# EAGLE schematic V1d (EAGLE 6.5.0)
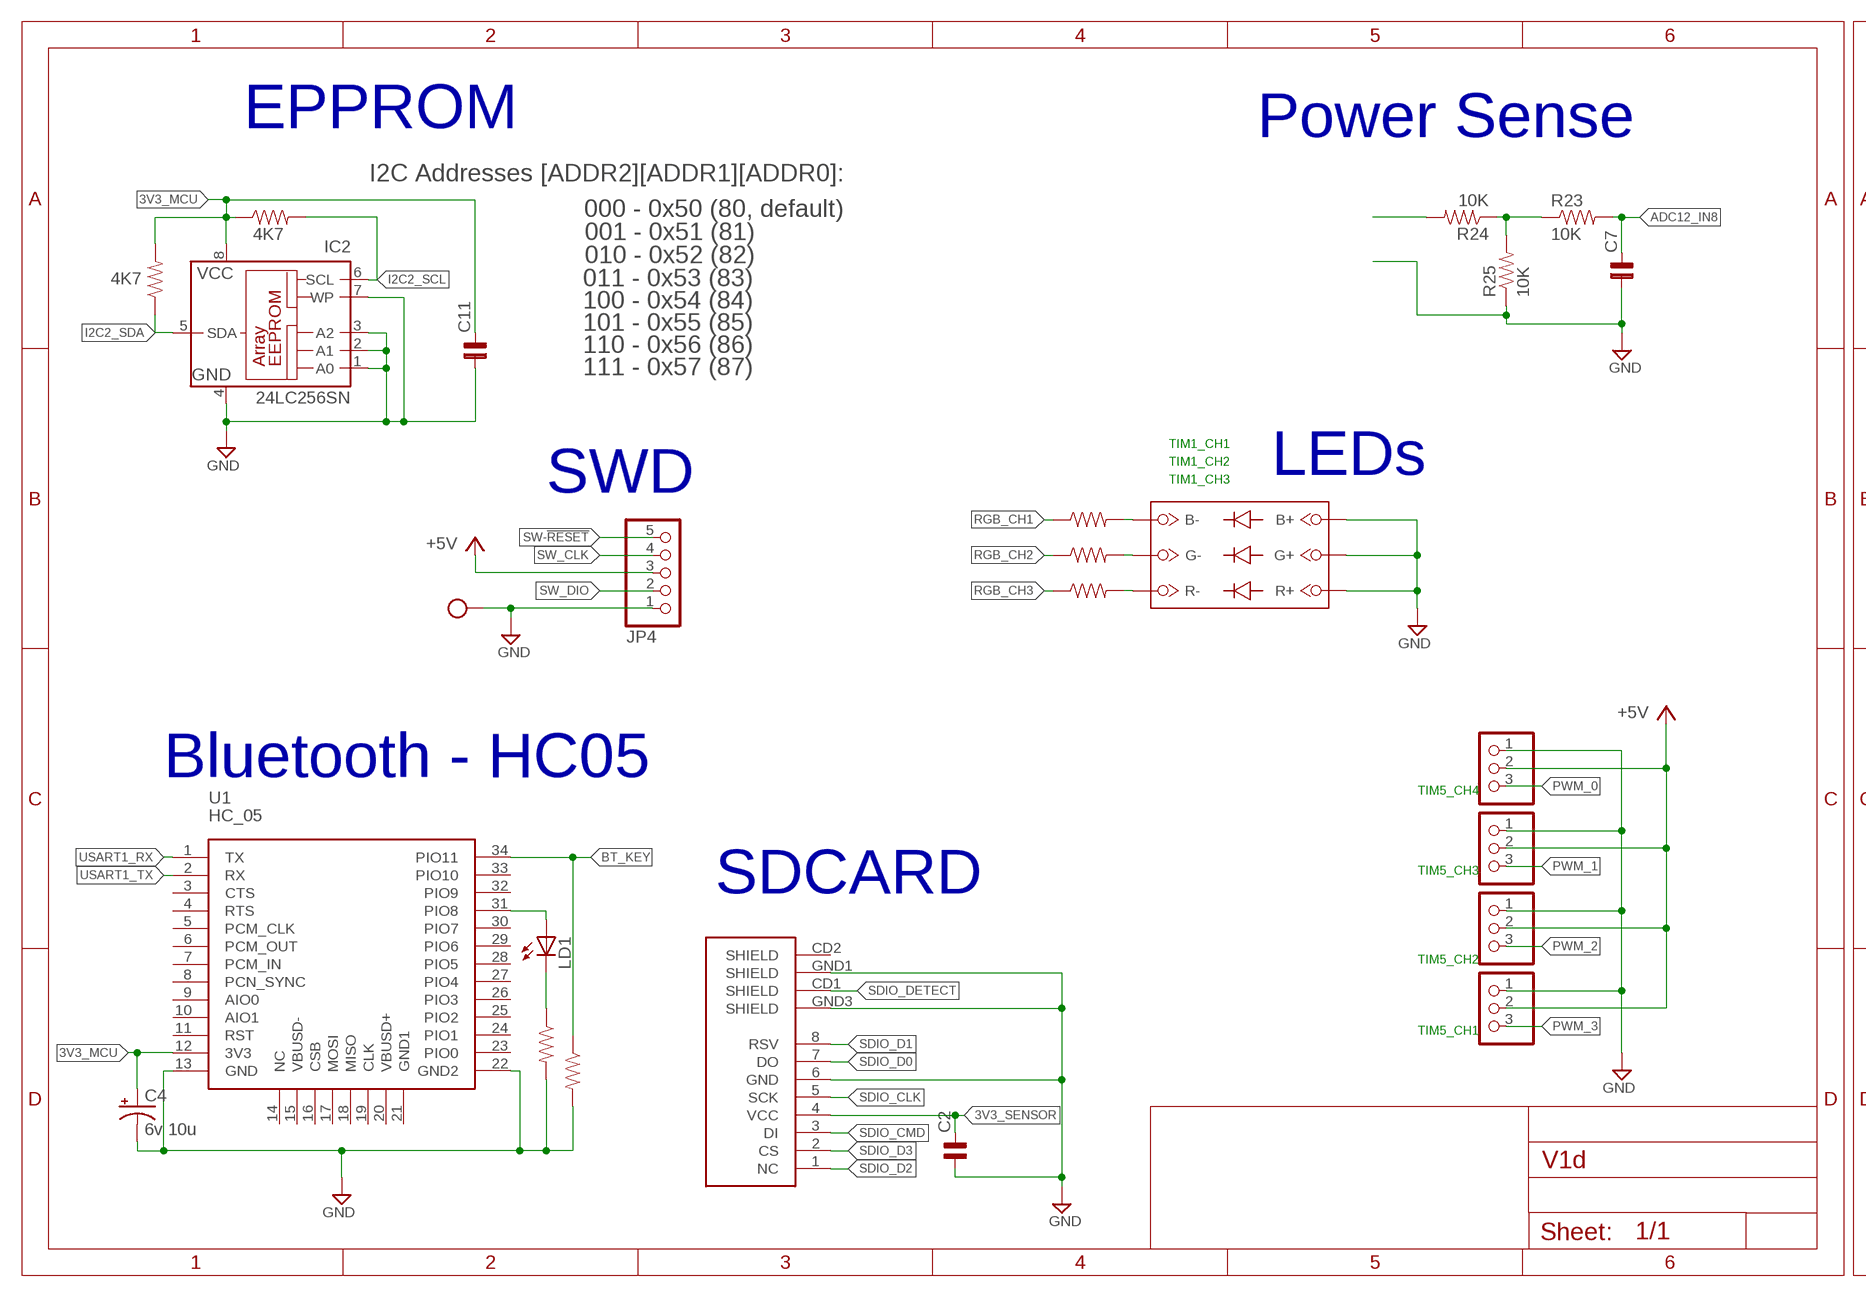
[diagram p0: schematic, sheet 1, part 1 of 2]
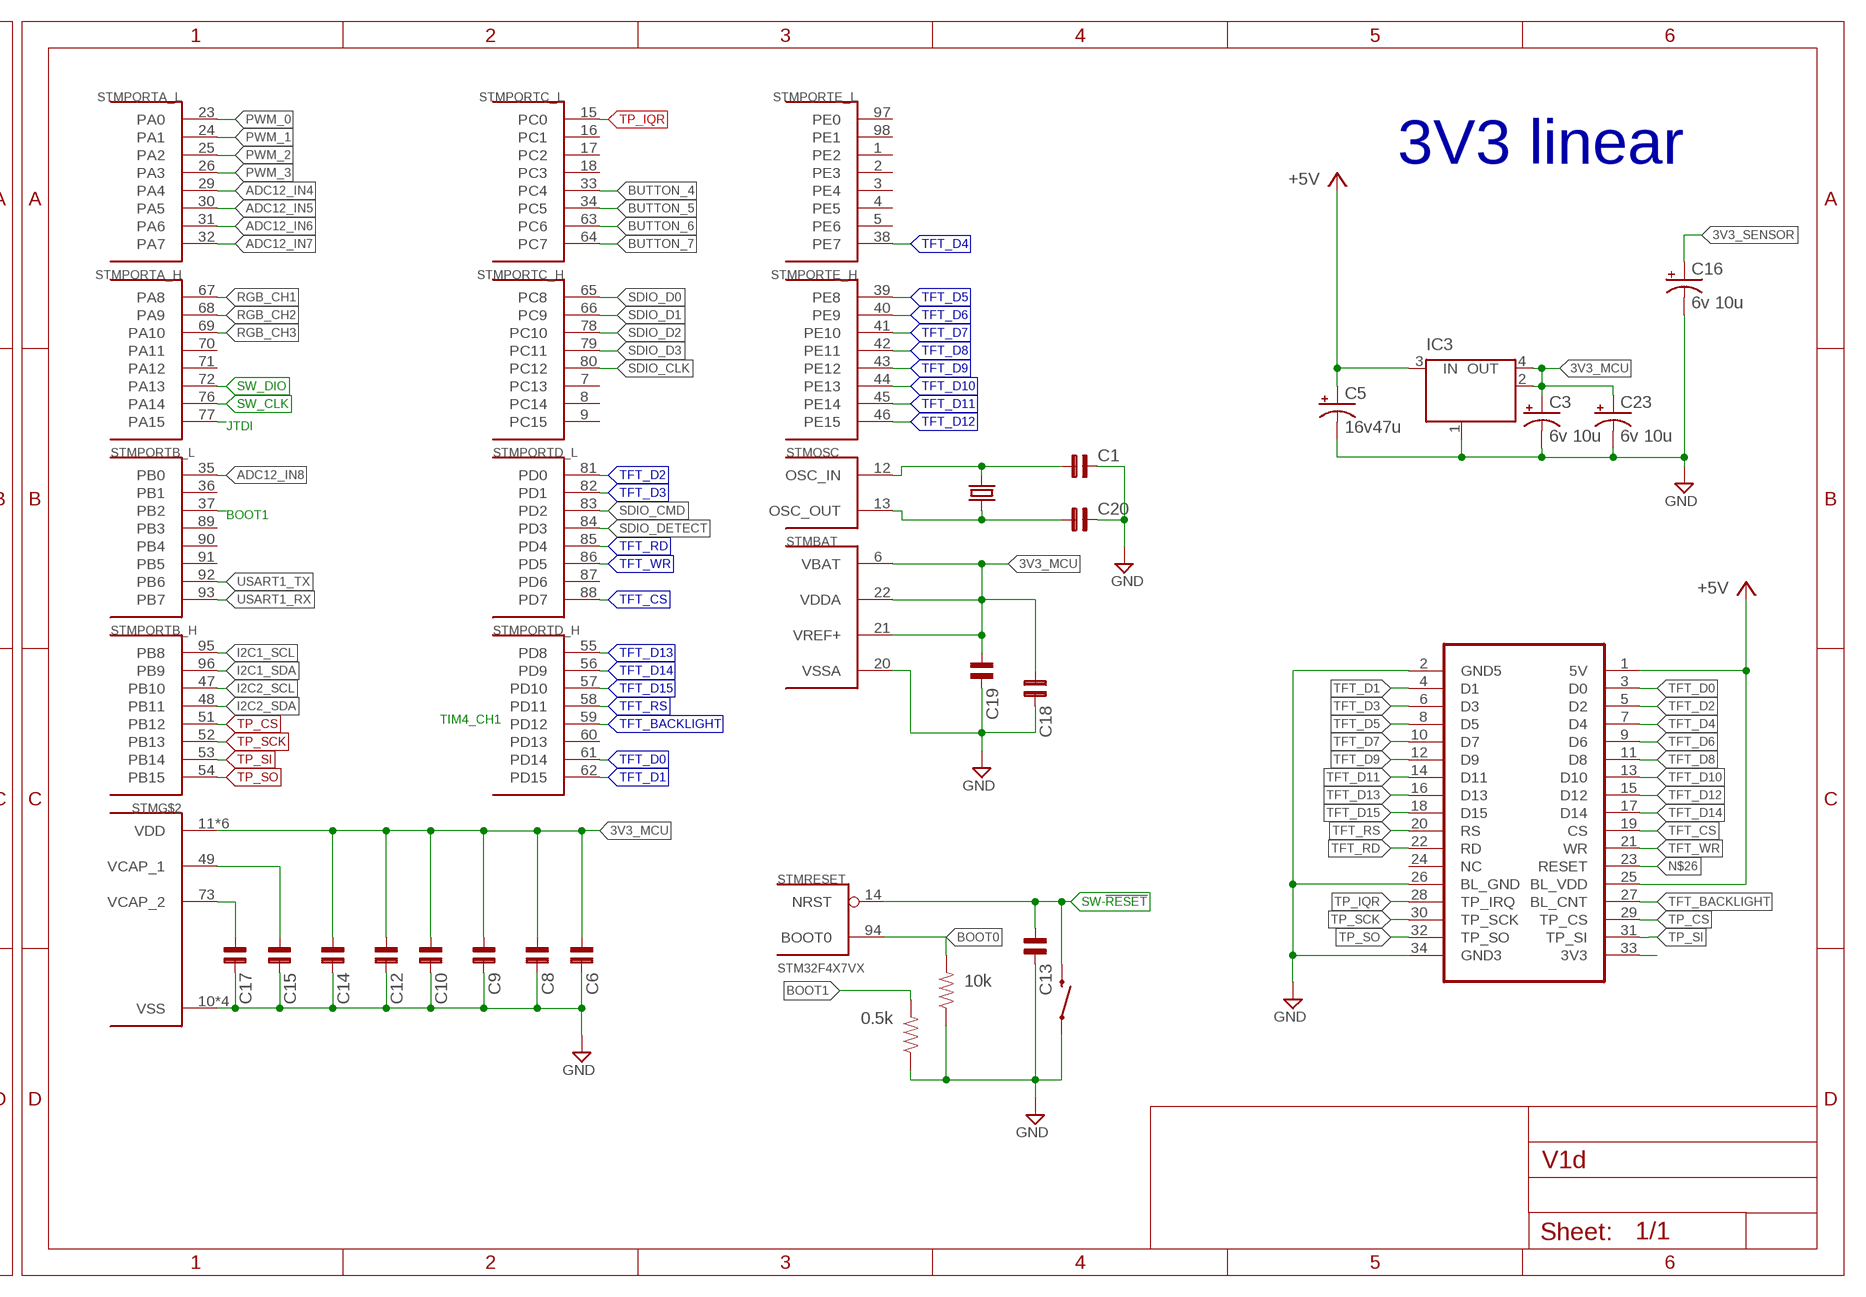
[diagram p1: schematic, sheet 1, part 2 of 2]

## Parts
C1  C-NP-SMD-0603  [C-0603]
C2  C-NP-SMD-0603  [C-0603]
C3  6v 10u  CPOL-USSMCA  [SMC_A]
C4  6v 10u  CPOL-USSMCA  [SMC_A]
C5  16v47u  CPOL-USSMCC  [SMC_C]
C6  C-NP-SMD-0603  [C-0603]
C7  C-NP-SMD-0603  [C-0603]
C8  C-NP-SMD-0603  [C-0603]
C9  C-NP-SMD-0603  [C-0603]
C10  C-NP-SMD-0603  [C-0603]
C11  C-NP-SMD-0603  [C-0603]
C12  C-NP-SMD-0603  [C-0603]
C13  C-NP-SMD-0603  [C-0603]
C14  C-NP-SMD-0603  [C-0603]
C15  C-NP-SMD-0603  [C-0603]
C16  6v 10u  CPOL-USSMCA  [SMC_A]
C17  C-NP-SMD-0603  [C-0603]
C18  C-NP-SMD-0603  [C-0603]
C19  C-NP-SMD-0603  [C-0603]
C20  C-NP-SMD-0603  [C-0603]
C23  6v 10u  CPOL-USSMCA  [SMC_A]
IC2  24LC256SN  [SO-08]
IC3  LINEAR_MC33269ST-3.3T3  [LINEAR_SOT223]
JP1  PINHD-1X3_2.54-90°  [1X03/90]
JP4  PINHD-1X5_2.54-90°  [1X05/90]
JP5  PINHD-1X3_2.54-90°  [1X03/90]
JP6  PINHD-1X3_2.54-90°  [1X03/90]
JP11  PINHD-1X3_2.54-90°  [1X03/90]
LD1  LEDCHIPLED_0805  [CHIPLED_0805]
R2  10K  SPARKFUN_RESISTOR0603-RES  [SPARKFUN_0603-RES]
R3  10K  SPARKFUN_RESISTOR0603-RES  [SPARKFUN_0603-RES]
R5  10K  SPARKFUN_RESISTOR0603-RES  [SPARKFUN_0603-RES]
R6  10K  SPARKFUN_RESISTOR0603-RES  [SPARKFUN_0603-RES]
R7  10k  SPARKFUN_RESISTOR0603-RES  [SPARKFUN_0603-RES]
R8  0.5k  SPARKFUN_RESISTOR0603-RES  [SPARKFUN_0603-RES]
R9  10K  SPARKFUN_RESISTOR0603-RES  [SPARKFUN_0603-RES]
R15  4K7  SPARKFUN_RESISTOR0603-RES  [SPARKFUN_0603-RES]
R16  4K7  SPARKFUN_RESISTOR0603-RES  [SPARKFUN_0603-RES]
R23  10K  SPARKFUN_RESISTOR0603-RES  [SPARKFUN_0603-RES]
R24  10K  SPARKFUN_RESISTOR0603-RES  [SPARKFUN_0603-RES]
R25  10K  SPARKFUN_RESISTOR0603-RES  [SPARKFUN_0603-RES]
S1  RESET  SWITCH-MOMENTARY-2-SMD-1101NE  [TACTILE-SWITCH-1101NE]
SDCARD2  microSD Socket  USD-SOCKETNEW  [MICRO-SD-SOCKET-PP]
STM  STM32F4X7VX  [TQFP100]
U1  HC_05  [BLUETOOTH_SMD]
U$3  TFT3.2  [HY32D_2]
U$12  RGB_LED  [SMD]
X1  MKDSN1,5/2-5,08  [MKDSN1,5/2-5,08]
Y1  CRYSTALHC49US  [HC49US]

## Nets
3V3_MCU: C3.+ C4.+ C6.1 C8.1 C9.1 C10.1 C11.2 C12.1 C14.1 C18.1 C19.1 C23.+ IC2.8(VCC) IC3.2(OUT) IC3.4(OUT) R15.1 R16.2 STM.6(BAT:VBAT) STM.11(VDD) STM.19(VDD) STM.21(BAT:VREF+) STM.22(BAT:VDDA) STM.28(VDD) STM.50(VDD) STM.75(VDD) STM.100(VDD) U1.12(3V3)
3V3_SENSOR: C2.2 C16.+ SDCARD2.4(VCC)
+5V: C5.+ IC3.3(IN) JP1.2 JP4.3 JP5.2 JP6.2 JP11.2 U$3.1(5V) U$3.25(BL_VDD)
ADC12_IN4: STM.29(PORTA_L:PA4)
ADC12_IN5: STM.30(PORTA_L:PA5)
ADC12_IN6: STM.31(PORTA_L:PA6)
ADC12_IN7: STM.32(PORTA_L:PA7)
ADC12_IN8: C7.2 R23.2 STM.35(PORTB_L:PB0)
BOOT0: R7.2 STM.94(RESET:BOOT0)
BOOT1: R8.2 STM.37(PORTB_L:PB2)
BT_KEY: R5.1 U1.34(PIO11)
BUTTON_4: STM.33(PORTC_L:PC4)
BUTTON_5: STM.34(PORTC_L:PC5)
BUTTON_6: STM.63(PORTC_L:PC6)
BUTTON_7: STM.64(PORTC_L:PC7)
GND: C1.2 C2.1 C3.- C4.- C5.- C6.2 C7.1 C8.2 C9.2 C10.2 C11.1 C12.2 C13.2 C14.2 C15.2 C16.- C17.2 C18.2 C19.2 C20.2 C23.- IC2.1(A0) IC2.2(A1) IC2.3(A2) IC2.4(GND) IC2.7(WP) IC3.1(GND/ADJ) JP1.1 JP4.1 JP5.1 JP6.1 JP11.1 R5.2 R7.1 R8.1 R9.2 R25.1 S1.P$1 SDCARD2.6(GND) SDCARD2.GND1(SHIELD) SDCARD2.GND3(SHIELD) STM.10(VSS) STM.20(BAT:VSSA) STM.27(VSS) STM.74(VSS) STM.99(VSS) U1.13(GND) U1.22(GND2) U$3.2(GND5) U$3.26(BL_GND) U$3.34(GND3) U$12.B+ U$12.G+ U$12.R+ X1.2
I2C1_SCL: STM.95(PORTB_H:PB8)
I2C1_SDA: STM.96(PORTB_H:PB9)
I2C2_SCL: IC2.6(SCL) R15.2 STM.47(PORTB_H:PB10)
I2C2_SDA: IC2.5(SDA) R16.1 STM.48(PORTB_H:PB11)
JTDI: STM.77(PORTA_H:PA15)
N$1: C1.1 STM.12(OSC:OSC_IN) Y1.2
N$2: R2.2 U$12.B-
N$3: R24.2
N$4: LD1.A U1.31(PIO8)
N$5: LD1.C R9.1
N$6: R3.2 U$12.G-
N$7: R6.2 U$12.R-
N$26: U$3.23(RESET)
N$27: R23.1 R24.1 R25.2
N$29: C20.1 STM.13(OSC:OSC_OUT) Y1.1
N$30: U$3.33(3V3)
N$31: C17.1 STM.73(VCAP_2)
N$32: C15.1 STM.49(VCAP_1)
PWM_0: JP6.3 STM.23(PORTA_L:PA0)
PWM_1: JP11.3 STM.24(PORTA_L:PA1)
PWM_2: JP5.3 STM.25(PORTA_L:PA2)
PWM_3: JP1.3 STM.26(PORTA_L:PA3)
RGB_CH1: R2.1 STM.67(PORTA_H:PA8)
RGB_CH2: R3.1 STM.68(PORTA_H:PA9)
RGB_CH3: R6.1 STM.69(PORTA_H:PA10)
SDIO_CLK: SDCARD2.5(SCK) STM.80(PORTC_H:PC12)
SDIO_CMD: SDCARD2.3(DI) STM.83(PORTD_L:PD2)
SDIO_D0: SDCARD2.7(DO) STM.65(PORTC_H:PC8)
SDIO_D1: SDCARD2.8(RSV) STM.66(PORTC_H:PC9)
SDIO_D2: SDCARD2.1(NC) STM.78(PORTC_H:PC10)
SDIO_D3: SDCARD2.2(CS) STM.79(PORTC_H:PC11)
SDIO_DETECT: SDCARD2.CD1(SHIELD) STM.84(PORTD_L:PD3)
SW-!RESET: C13.1 JP4.5 S1.P$2 STM.14(RESET:NRST)
SW_CLK: JP4.4 STM.76(PORTA_H:PA14)
SW_DIO: JP4.2 STM.72(PORTA_H:PA13)
TFT_BACKLIGHT: STM.59(PORTD_H:PD12) U$3.27(BL_CNT)
TFT_CS: STM.88(PORTD_L:PD7) U$3.19(CS)
TFT_D0: STM.61(PORTD_H:PD14) U$3.3(D0)
TFT_D1: STM.62(PORTD_H:PD15) U$3.4(D1)
TFT_D2: STM.81(PORTD_L:PD0) U$3.5(D2)
TFT_D3: STM.82(PORTD_L:PD1) U$3.6(D3)
TFT_D4: STM.38(PORTE_L:PE7) U$3.7(D4)
TFT_D5: STM.39(PORTE_H:PE8) U$3.8(D5)
TFT_D6: STM.40(PORTE_H:PE9) U$3.9(D6)
TFT_D7: STM.41(PORTE_H:PE10) U$3.10(D7)
TFT_D8: STM.42(PORTE_H:PE11) U$3.11(D8)
TFT_D9: STM.43(PORTE_H:PE12) U$3.12(D9)
TFT_D10: STM.44(PORTE_H:PE13) U$3.13(D10)
TFT_D11: STM.45(PORTE_H:PE14) U$3.14(D11)
TFT_D12: STM.46(PORTE_H:PE15) U$3.15(D12)
TFT_D13: STM.55(PORTD_H:PD8) U$3.16(D13)
TFT_D14: STM.56(PORTD_H:PD9) U$3.17(D14)
TFT_D15: STM.57(PORTD_H:PD10) U$3.18(D15)
TFT_RD: STM.85(PORTD_L:PD4) U$3.22(RD)
TFT_RS: STM.58(PORTD_H:PD11) U$3.20(RS)
TFT_WR: STM.86(PORTD_L:PD5) U$3.21(WR)
TP_CS: STM.51(PORTB_H:PB12) U$3.29(TP_CS)
TP_IQR: STM.15(PORTC_L:PC0) U$3.28(TP_IRQ)
TP_SCK: STM.52(PORTB_H:PB13) U$3.30(TP_SCK)
TP_SI: STM.53(PORTB_H:PB14) U$3.31(TP_SI)
TP_SO: STM.54(PORTB_H:PB15) U$3.32(TP_SO)
USART1_RX: STM.93(PORTB_L:PB7) U1.1(TX)
USART1_TX: STM.92(PORTB_L:PB6) U1.2(RX)
Unconnected: SDCARD2.CD2(SHIELD) STM.1(PORTE_L:PE2) STM.2(PORTE_L:PE3) STM.3(PORTE_L:PE4) STM.4(PORTE_L:PE5) STM.5(PORTE_L:PE6) STM.7(PORTC_H:PC13) STM.8(PORTC_H:PC14) STM.9(PORTC_H:PC15) STM.16(PORTC_L:PC1) STM.17(PORTC_L:PC2) STM.18(PORTC_L:PC3) STM.36(PORTB_L:PB1) STM.60(PORTD_H:PD13) STM.70(PORTA_H:PA11) STM.71(PORTA_H:PA12) STM.87(PORTD_L:PD6) STM.89(PORTB_L:PB3) STM.90(PORTB_L:PB4) STM.91(PORTB_L:PB5) STM.97(PORTE_L:PE0) STM.98(PORTE_L:PE1) U1.3(CTS) U1.4(RTS) U1.5(PCM_CLK) U1.6(PCM_OUT) U1.7(PCM_IN) U1.8(PCN_SYNC) U1.9(AIO0) U1.10(AIO1) U1.11(RST) U1.14(NC) U1.15(VBUSD-) U1.16(CSB) U1.17(MOSI) U1.18(MISO) U1.19(CLK) U1.20(VBUSD+) U1.21(GND1) U1.23(PIO0) U1.24(PIO1) U1.25(PIO2) U1.26(PIO3) U1.27(PIO4) U1.28(PIO5) U1.29(PIO6) U1.30(PIO7) U1.32(PIO9) U1.33(PIO10) U$3.24(NC) X1.1

## Notes on the sheet
- EPPROM | Power Sense
- 3V3 linear
- I2C Addresses [ADDR2][ADDR1][ADDR0]:
- 000 - 0x50 (80, default)
- 001 - 0x51 (81)
- 010 - 0x52 (82)
- 011 - 0x53 (83)
- 100 - 0x54 (84)
- 101 - 0x55 (85)
- 110 - 0x56 (86)
- 111 - 0x57 (87)
- TIM1_CH1
- TIM1_CH2
- LEDs
- TIM1_CH3
- SWD
- TIM4_CH1
- Bluetooth - HC05
- TIM5_CH4
- SDCARD
- TIM5_CH3
- TIM5_CH2
- TIM5_CH1
- TJA1040

## Library data of the parts
C1 C2 C6-C15 C17-C20 = cap-pan40:C-NP: NON-POLARIZED FILM/CHIP
C3-C5 C16 C23 = rcl:CPOL-US: POLARIZED CAPACITOR, American symbol
IC2 = microchip:24*: Serial EEPROM I2C; DIGIKEY: 24LC256-E/SN-ND; MF: MICROCHIP; MPN: 24LC256-I/SN; OC_FARNELL: 9757996; OC_NEWARK: 27C9144
IC3 = Robotech_Other:LINEAR_MC33269ST*: Adjustable Output Low Dropout Voltage Regulator 800 mA Source: http://www.onsemi.com/pub/Collateral/MC33269-D.PDF
JP1 JP5 JP6 JP11 = pinhead-1:PINHD-1X3: PIN HEADER
JP4 = pinhead-1:PINHD-1X5: PIN HEADER
LD1 = led:LED: LED OSRAM: - CHIPLED LG R971, LG N971, LY N971, LG Q971, LY Q971, LO R971, LY R971 LH N974, LH R974 LS Q976, LO Q976, LY Q976 LO Q996 - Hyper CHIPLED LW Q18S LB Q993, LB Q99A, LB R99A - SideLED LS A670, LO A670, LY A670, LG A670, LP A670 LB A673, LV A673, LT A673, LW A673 LH A674 LY A675 LS A676, LA A676, LO A676, LY A676, LW A676 LS A679, LY A679, LG A679 - Hyper Micro SIDELED® LS Y876, LA Y876, LO Y876, LY Y876 LT Y87S - SmartLED LW L88C, LW L88S LB L89C, LB L89S, LG L890 LS L89K, LO L89K, LY L89K LS L896, LA L896, LO L896, LY L896 - TOPLED LS T670, LO T670, LY T670, LG T670, LP T670 LSG T670, LSP T670, LSY T670, LOP T670, LYG T670 LG T671, LOG T671, LSG T671 LB T673, LV T673, LT T673, LW T673 LH T674 LS T676, LA T676, LO T676, LY T676, LB T676, LH T676, LSB T676, LW T676 LB T67C, LV T67C, LT T67C, LS T67K, LO T67K, LY T67K, LW E67C LS E67B, LA E67B, LO E67B, LY E67B, LB E67C, LV E67C, LT E67C LW T67C LS T679, LY T679, LG T679 LS T770, LO T770, LY T770, LG T770, LP T770 LB T773, LV T773, LT T773, LW T773 LH T774 LS E675, LA E675, LY E675, LS T675 LS T776, LA T776, LO T776, LY T776, LB T776 LHGB T686 LT T68C, LB T68C - Hyper Mini TOPLED® LB M676 - Mini TOPLED Santana® LG M470 LS M47K, LO M47K, LY M47K Source: http://www.osram.convergy.de/
R2 R3 R5-R9 R15 R16 R23-R25 = Robotech_RCL:SPARKFUN_RESISTOR: Resistor Basic schematic elements and footprints for 0603, 1206, and PTH resistors.
S1 = pixhawk2:SWITCH-MOMENTARY-2; PARTNO: EVQ-P7J01P
SDCARD2 = SparkFun:USD-SOCKET: microSD Socket Push-push type uSD socket. Schematic element and footprint production proven. Spark Fun Electronics SKU : PRT-00127. tDoc lines correctly indicate media card edge positions when inserting (unlocked, locked, depressed).
STM = pixhawk2:STM32F4X7VX: STM32F4X7VX 100 pin LQFP STM32F407VE - 512 KB flash, no crypto STM32F407VG - 1 MB flash, no crypto STM32F417VE - 512 KB flash, with crypto STM32F417VG - 1 MB flash, with crypto; PARTNO: STM32F427VI
U1 = SerialPortBluetooth:HC_05
U$3 = TFT:TFT3.2
U$12 = RGB_LED:RGB_LED
X1 = con-phoenix-508:MKDSN1,5/2-5,08: MKDSN 1,5/ 2-5,08 Printklemme Nennstrom: 13,5 A Nennspannung: 250 V Rastermaß: 5,08 mm Polzahl: 2 Anschlussart: Schraubanschluss Montage: Löten Anschlussrichtung Leiter/Platine: 0 ° Artikelnummer: 1729128 Source: http://eshop.phoenixcontact.com .. 1729128.pdf; MPN: MKDSN 1,5/2-5.08; OC_FARNELL: 1792903; OC_NEWARK: 30M2397
Y1 = SparkFun-FreqCtrl:CRYSTAL: Various standard crystals. Proven footprints. Spark Fun Electronics SKU : COM-00534

## Net classes
0 Default: width 0.203 mm
1 power: width 0.15 mm, drill 0.2 mm, clearance 0.152 mm